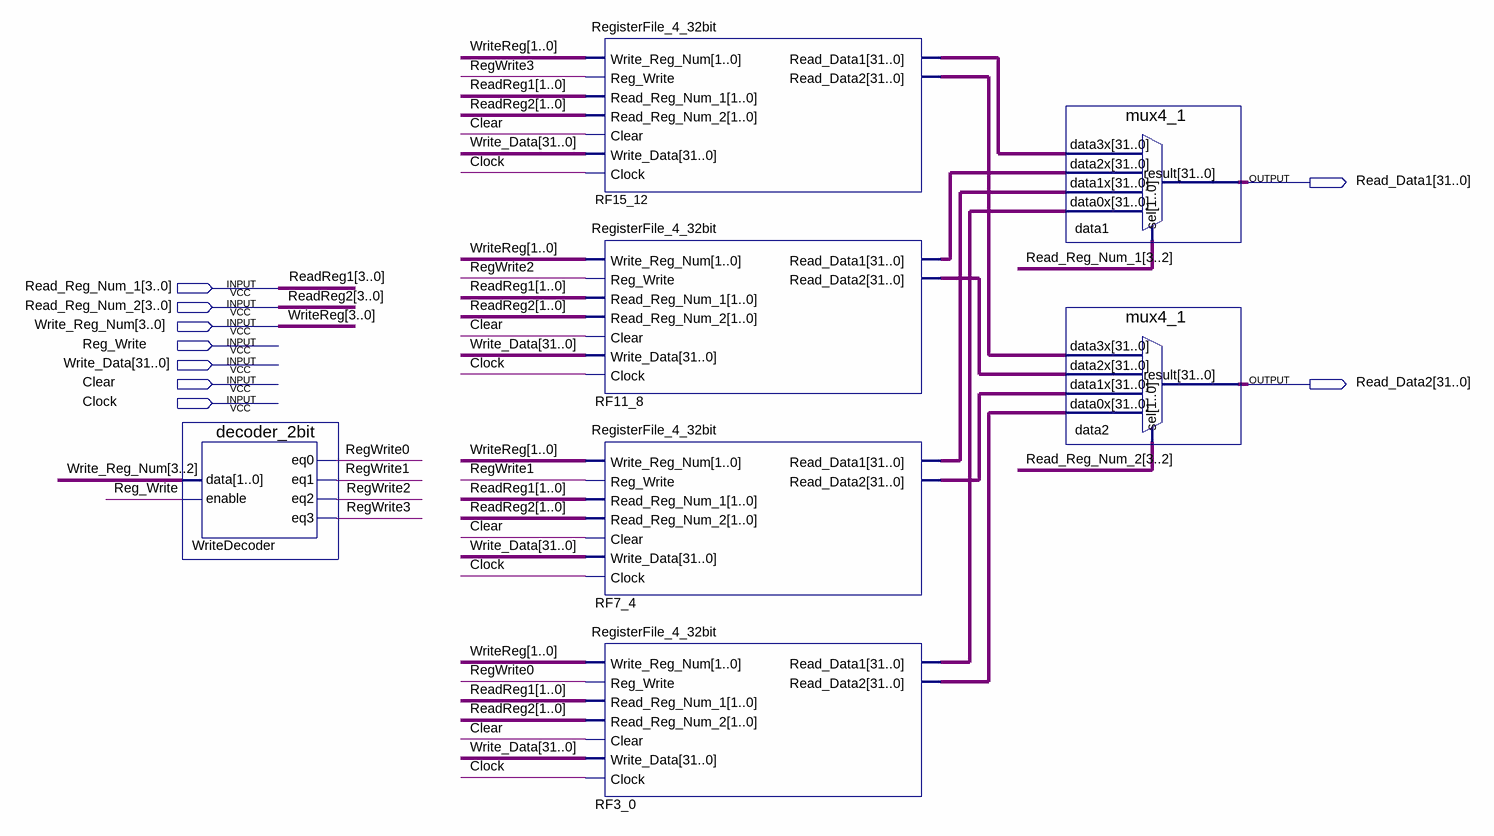
[diagram p0: schematic sheet]
// Quartus schematic RegisterFile_16_32bit.bdf as structural Verilog: 7 symbols, 9 pins
module RegisterFile_16_32bit (
  input  [3:0] Read_Reg_Num_1,
  input  [3:0] Read_Reg_Num_2,
  input  [3:0] Write_Reg_Num,
  input  Reg_Write,
  input  [31:0] Write_Data,
  input  Clear,
  input  Clock,
  output [31:0] Read_Data1,
  output [31:0] Read_Data2
);

  wire RegWrite0, RegWrite1, RegWrite2, RegWrite3;
  wire [31:0] RF3_0_read_data1, RF3_0_read_data2, RF7_4_read_data1, RF7_4_read_data2, RF11_8_read_data1,
       RF11_8_read_data2, RF15_12_read_data1, RF15_12_read_data2;

  decoder_2bit WriteDecoder (
    .data(Write_Reg_Num[3:2]), .enable(Reg_Write), .eq0(RegWrite0), .eq1(RegWrite1), .eq2(RegWrite2),
    .eq3(RegWrite3));
  RegisterFile_4_32bit RF15_12 (
    .Write_Reg_Num(Write_Reg_Num[1:0]), .Reg_Write(RegWrite3), .Read_Reg_Num_1(Read_Reg_Num_1[1:0]),
    .Read_Reg_Num_2(Read_Reg_Num_2[1:0]), .Clear(Clear), .Write_Data(Write_Data), .Clock(Clock),
    .Read_Data1(RF15_12_read_data1), .Read_Data2(RF15_12_read_data2));
  RegisterFile_4_32bit RF11_8 (
    .Write_Reg_Num(Write_Reg_Num[1:0]), .Reg_Write(RegWrite2), .Read_Reg_Num_1(Read_Reg_Num_1[1:0]),
    .Read_Reg_Num_2(Read_Reg_Num_2[1:0]), .Clear(Clear), .Write_Data(Write_Data), .Clock(Clock),
    .Read_Data1(RF11_8_read_data1), .Read_Data2(RF11_8_read_data2));
  RegisterFile_4_32bit RF7_4 (
    .Write_Reg_Num(Write_Reg_Num[1:0]), .Reg_Write(RegWrite1), .Read_Reg_Num_1(Read_Reg_Num_1[1:0]),
    .Read_Reg_Num_2(Read_Reg_Num_2[1:0]), .Clear(Clear), .Write_Data(Write_Data), .Clock(Clock),
    .Read_Data1(RF7_4_read_data1), .Read_Data2(RF7_4_read_data2));
  RegisterFile_4_32bit RF3_0 (
    .Write_Reg_Num(Write_Reg_Num[1:0]), .Reg_Write(RegWrite0), .Read_Reg_Num_1(Read_Reg_Num_1[1:0]),
    .Read_Reg_Num_2(Read_Reg_Num_2[1:0]), .Clear(Clear), .Write_Data(Write_Data), .Clock(Clock),
    .Read_Data1(RF3_0_read_data1), .Read_Data2(RF3_0_read_data2));
  mux4_1 data1 (
    .data3x(RF15_12_read_data1), .data2x(RF11_8_read_data1), .data1x(RF7_4_read_data1),
    .data0x(RF3_0_read_data1), .sel(Read_Reg_Num_1[3:2]), .result(Read_Data1));
  mux4_1 data2 (
    .data3x(RF15_12_read_data2), .data2x(RF11_8_read_data2), .data1x(RF7_4_read_data2),
    .data0x(RF3_0_read_data2), .sel(Read_Reg_Num_2[3:2]), .result(Read_Data2));

  // Other names for the same wires on the sheet: ReadReg1[3:0] = Read_Reg_Num_1; ReadReg2[3:0] = Read_Reg_Num_2;
  //   WriteReg[3:0] = Write_Reg_Num
endmodule
